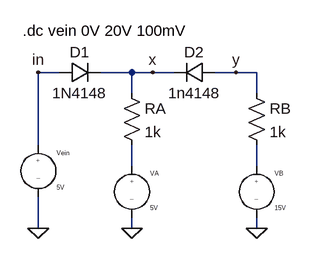
[diagram p0: schematic 2-dioden-schaltung.asc]
2-dioden-schaltung.asc, the LTspice schematic file:
Version 4
SHEET 1 880 680
WIRE 112 160 80 160
WIRE 224 160 176 160
WIRE 256 160 224 160
WIRE 288 160 256 160
WIRE 384 160 352 160
WIRE 416 160 384 160
WIRE 224 192 224 160
WIRE 416 192 416 160
WIRE 80 272 80 160
WIRE 224 304 224 272
WIRE 416 304 416 272
WIRE 80 400 80 352
WIRE 224 400 224 384
WIRE 416 400 416 384
FLAG 416 400 0
FLAG 80 400 0
FLAG 256 160 x
FLAG 384 160 y
FLAG 224 400 0
FLAG 80 160 in
SYMBOL res 208 176 R0
SYMATTR InstName RA
SYMATTR Value 1k
SYMBOL res 400 176 R0
SYMATTR InstName RB
SYMATTR Value 1k
SYMBOL source-V 224 288 R0
SYMATTR InstName VA
SYMATTR Value 5V
SYMBOL source-V 416 288 R0
SYMATTR InstName VB
SYMATTR Value 15V
SYMBOL source-V 80 256 R0
SYMATTR InstName Vein
SYMATTR Value 5V
SYMBOL diode 352 144 R90
WINDOW 0 0 32 VBottom 2
WINDOW 3 32 32 VTop 2
SYMATTR InstName D2
SYMATTR Value 1n4148
SYMBOL diode 112 176 R270
WINDOW 0 32 32 VTop 2
WINDOW 3 0 32 VBottom 2
SYMATTR InstName D1
SYMATTR Value 1N4148
TEXT 56 96 Left 2 !.dc vein 0V 20V 100mV

The netlist it stands for:
* 2-dioden-schaltung.asc
RA x N001 1k
RB y N002 1k
VA N001 0 5V
VB N002 0 15V
Vein in 0 5V
D2 y x 1n4148
D1 in x 1N4148
.model D D
.lib standard.dio
.dc vein 0V 20V 100mV
.backanno
.end